# EasyEDA Pro project ProPrj_（课设）太阳能板最大功率点追踪主控板 Solar MPPT Tracking controlling board_2024-09-24.epro, board PCB3
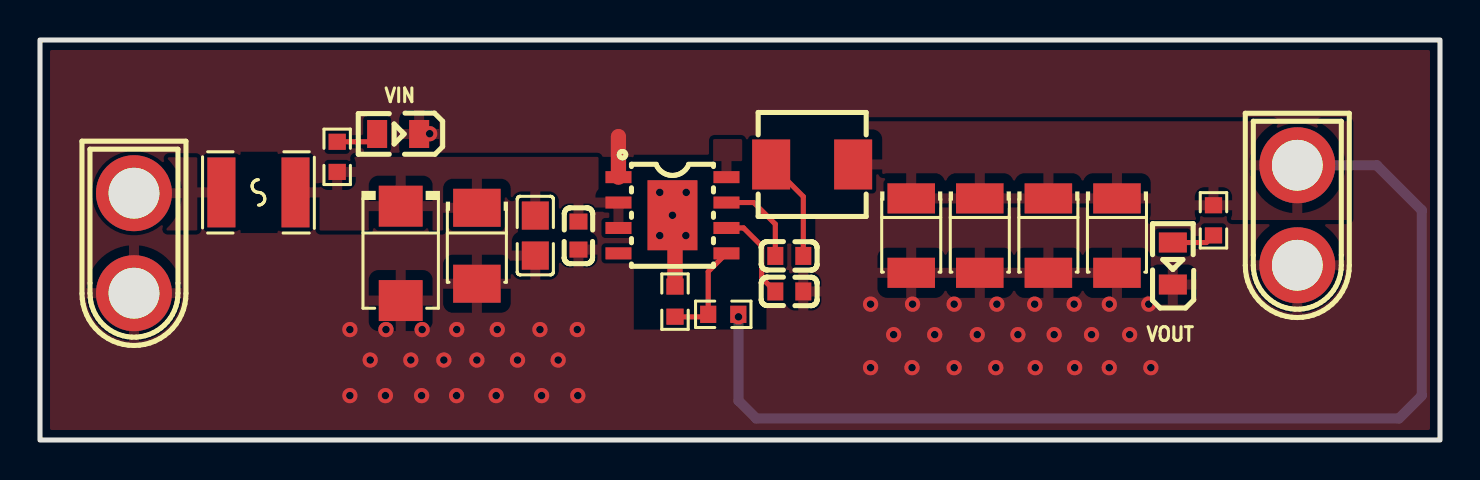
[diagram p6: board, top side]
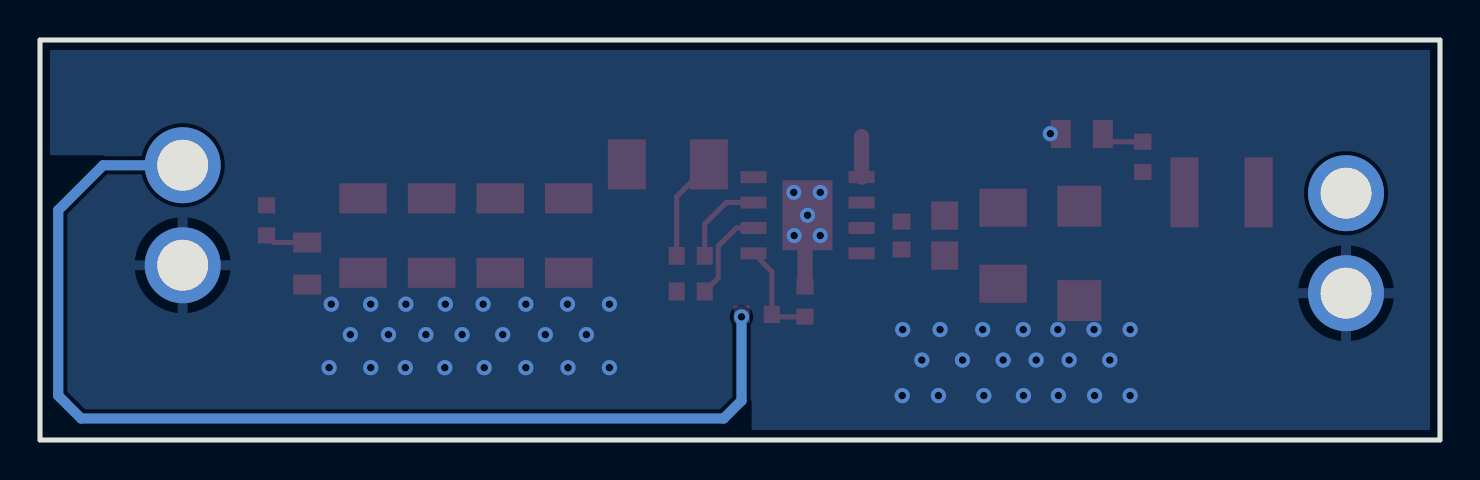
[diagram p7: board, bottom side, seen from below]

Outline 70 x 20 mm; copper layers: Top Layer, Bottom Layer. Coordinates in mm from the lower left corner of the outline.
Outline path: rectangle 0,20 70,0
Stack: Top Layer 0.035mm / Dielectric1 1.51mm FR4 er 4.5 / Bottom Layer 0.035mm

## Design rules (mm)
template: 自定义配置
spacing copperThickness1oz (default): track to track 0.102, other pairs 0.152 to 0.3
spacing copperThickness2oz: track to track 0.203, other pairs 0.152 to 0.3
track width copperThickness1oz (default): min 0.127, default 0.254, max 2.54
track width copperThickness2oz: min 0.203, default 0.254, max 2.54
differential pair differentialPair (default): width min 0.127, default 0.254, max 2.54; gap min 0.152, default 0.152
via viaSize (default): diameter min 0.5, default 0.61, max 10; hole min 0.3, default 0.305, max 6.3

## Placement (name value [footprint] x y rotation side)
C9  100nF  [C0603]  37.46 9.2 0 top
C14  1uF  [C0603]  37.46 7.43 0 top
C15  220nF  [C0603]  26.92 10.22 90 top
C16  10uF  [C0805]  24.77 10.22 90 top
C17  22uF  [CASE-B_3528]  43.56 10.22 270 top
C18  22uF  [CASE-B_3528]  46.99 10.22 270 top
C19  22uF  [CASE-B_3528]  50.42 10.22 270 top
C20  22uF  [CASE-B_3528]  53.85 10.22 270 top
C21  10uF  [CAP-SMD_L3.5-W2.8-R-RD]  21.84 9.71 90 top
CN1  XT30U-M  [CONN-TH_XT30U-M]  62.86 11.24 270 top
CN2  XT30U-M  [CONN-TH_XT30U-M]  4.7 9.84 270 top
D1  SMBJ20A  [SMB_L4.5-W3.7-LS5.4-RD]  18.03 9.33 270 top
F1  BSMD1812-200-24V  [F1812]  10.92 12.38 180 top
L2  6.8uH  [IND-SMD_L5.4-W5.2_FXL0530]  38.61 13.78 0 top
R3  100K  [R0603]  34.16 6.28 0 top
R4  43K  [R0603]  31.75 6.92 270 top
R5  10K  [R0603]  14.86 14.16 270 top
R6  10K  [R0603]  58.67 10.98 90 top
U2  LMR33630ADDAR  [ESOP-8_L4.9-W3.9-P1.27-LS6.0-TL-EP]  31.62 11.24 0 top
VIN  NCD0805R1  [LED0805-R-RD]  17.91 15.3 180 top
VOUT  NCD0805R1  [LED0805-R-RD]  56.64 8.82 90 top

## Footprints (pads in the part's own frame, mm; a bottom-side part is the same pattern mirrored in y, then rotated)
C0603
  rect 0.8x0.9 smd: 1(-0.7,0) 2(0.7,0)
C0805
  rect 1.41x1.35 smd: 1(-1,0) 2(1,0)
CAP-SMD_L3.5-W2.8-R-RD
  rect 1.9x2.376 smd: 1(1.899,0) 2(-1.899,0)
CASE-B_3528
  rect 1.506x2.376 smd: 1(-1.861,0) 2(1.861,0)
CONN-TH_XT30U-M
  round 3.8 hole 2.54: 1(-2.5,0) 2(2.5,0)
ESOP-8_L4.9-W3.9-P1.27-LS6.0-TL-EP
  rect 1.3x0.6 smd: 1(-2.7,1.905) 2(-2.7,0.635) 3(-2.7,-0.635) 4(-2.7,-1.905) 5(2.7,-1.905) 6(2.7,-0.635) 7(2.7,0.635) 8(2.7,1.905)
  rect 2.5x3.5 smd: 9(0,0)
F1812
  rect 1.407x3.499 smd: 1(-1.853,0) 2(1.853,0)
IND-SMD_L5.4-W5.2_FXL0530
  rect 1.9x2.5 smd: 1(-2.05,0) 2(2.05,0)
LED0805-R-RD
  rect 1x1.399 smd: 1(1.05,0) 2(-1.05,0)
R0603
  rect 0.806x0.864 smd: 1(-0.753,0) 2(0.753,0)
SMB_L4.5-W3.7-LS5.4-RD
  rect 2.047x2.192 smd: 1(-2.361,0) 2(2.361,0)

## Nets
+18V: CN2.1 F1.2
GND: C14.2 C15.1 C16.1 C17.2 C18.2 C19.2 C20.2 C21.2 CN1.2 CN2.2 D1.2 R4.1 U2.1 U2.9 VIN.2 VOUT.2
STM32-3.3V: C17.1 C18.1 C19.1 C20.1 CN1.1 L2.2 R3.2 R6.2
$2N517: C9.1 U2.7
$2N518: C9.2 L2.1 U2.8
$2N519: C14.1 U2.6
$2N524: R3.1 R4.2 U2.5
$2N3881: R5.1 VIN.1
$2N4022: R6.1 VOUT.1
$2N4053: C15.2 C16.2 C21.1 D1.1 F1.1 R5.2 U2.2 U2.3

Pads without a net: U2 4

## Via types
v1: diameter 0.762, hole 0.381, Top Layer to Bottom Layer, 50 vias

## Routing (per net, layer and track width the routed paths; a pad name or vN(x,y) marks a point on that pad's centre or on a via; arc(x,y) is an arc through that point)
GND: length 5.6
  Top Layer w0.762: v1(31.62,11.24) 31.75,11.11 R4.1 ; U2.1 28.92,15.17
  vias: v1(15.49,5.52) v1(15.49,2.22) v1(16.51,4) v1(17.3,5.52) v1(17.27,2.22) v1(18.54,4) v1(19.11,5.52) v1(19.08,2.22) v1(19.48,15.31) v1(20.19,4) v1(20.84,5.52) v1(20.83,2.22) v1(21.84,4) v1(22.86,5.52) v1(22.81,2.22) v1(23.88,4) v1(25,5.52) v1(25.08,2.22) v1(25.91,4) v1(26.86,5.52) v1(26.89,2.22) v1(30.99,12.38) v1(30.99,10.22) v1(32.31,12.38) v1(32.29,10.22) v1(41.53,6.79) v1(41.53,3.62) v1(42.68,5.27) v1(43.63,6.79) v1(43.6,3.62) v1(44.74,5.27) v1(45.71,6.79) v1(45.71,3.62) v1(46.86,5.27) v1(47.84,6.79) v1(47.79,3.62) v1(48.89,5.27) v1(49.73,6.79) v1(49.76,3.62) v1(50.71,5.27) v1(51.71,6.79) v1(51.73,3.62) v1(52.58,5.27) v1(53.46,3.62) v1(53.47,6.79) v1(54.48,5.27) v1(55.44,6.79) v1(55.54,3.62)
STM32-3.3V: length 55.6
  Bottom Layer w0.508: CN1.1 66.84,13.74 69.09,11.49 69.09,2.22 67.95,1.08 35.81,1.08 34.92,1.97 v1(34.92,6.16)
$2N517: length 4.5
  Top Layer w0.254: U2.7 35.69,11.87 36.77,10.79 C9.1
$2N518: length 5.2
  Top Layer w0.254: L2.1 38.17,12.17 38.17,9.2
$2N519: length 4.7
  Top Layer w0.254: U2.6 35.18,10.6 36.09,9.7 36.09,8.11 C14.1
$2N524: length 5.2
  Top Layer w0.254: R4.2 31.76,6.16 33.41,6.16 33.41,8.42 U2.5
$2N3881: length 2.2
  Top Layer w0.254: R5.1 16.47,14.91 VIN.1
$2N4022: length 2.2
  Top Layer w0.254: VOUT.1 58.32,9.87 R6.1

## Copper pours and planes (outline as drawn; the poured copper is in the pictures)
+18V on Top Layer: 4.7,14.14 9.65,14.14 9.65,10.48 4.7,10.48
GND on Top Layer: 0,20 70,20 70,0 0,0
GND on Bottom Layer: 0,20 70,20 70,0 0,0
STM32-3.3V on Top Layer: 41.15,15.94 65.46,15.94 65.46,11 41.15,11
$2N518 on Top Layer: 33.66,15.05 35.94,15.05 35.94,12.51 33.66,12.51
$2N4053 on Top Layer: 12.19,14.16 29.59,14.16 29.59,10.48 12.19,10.48
